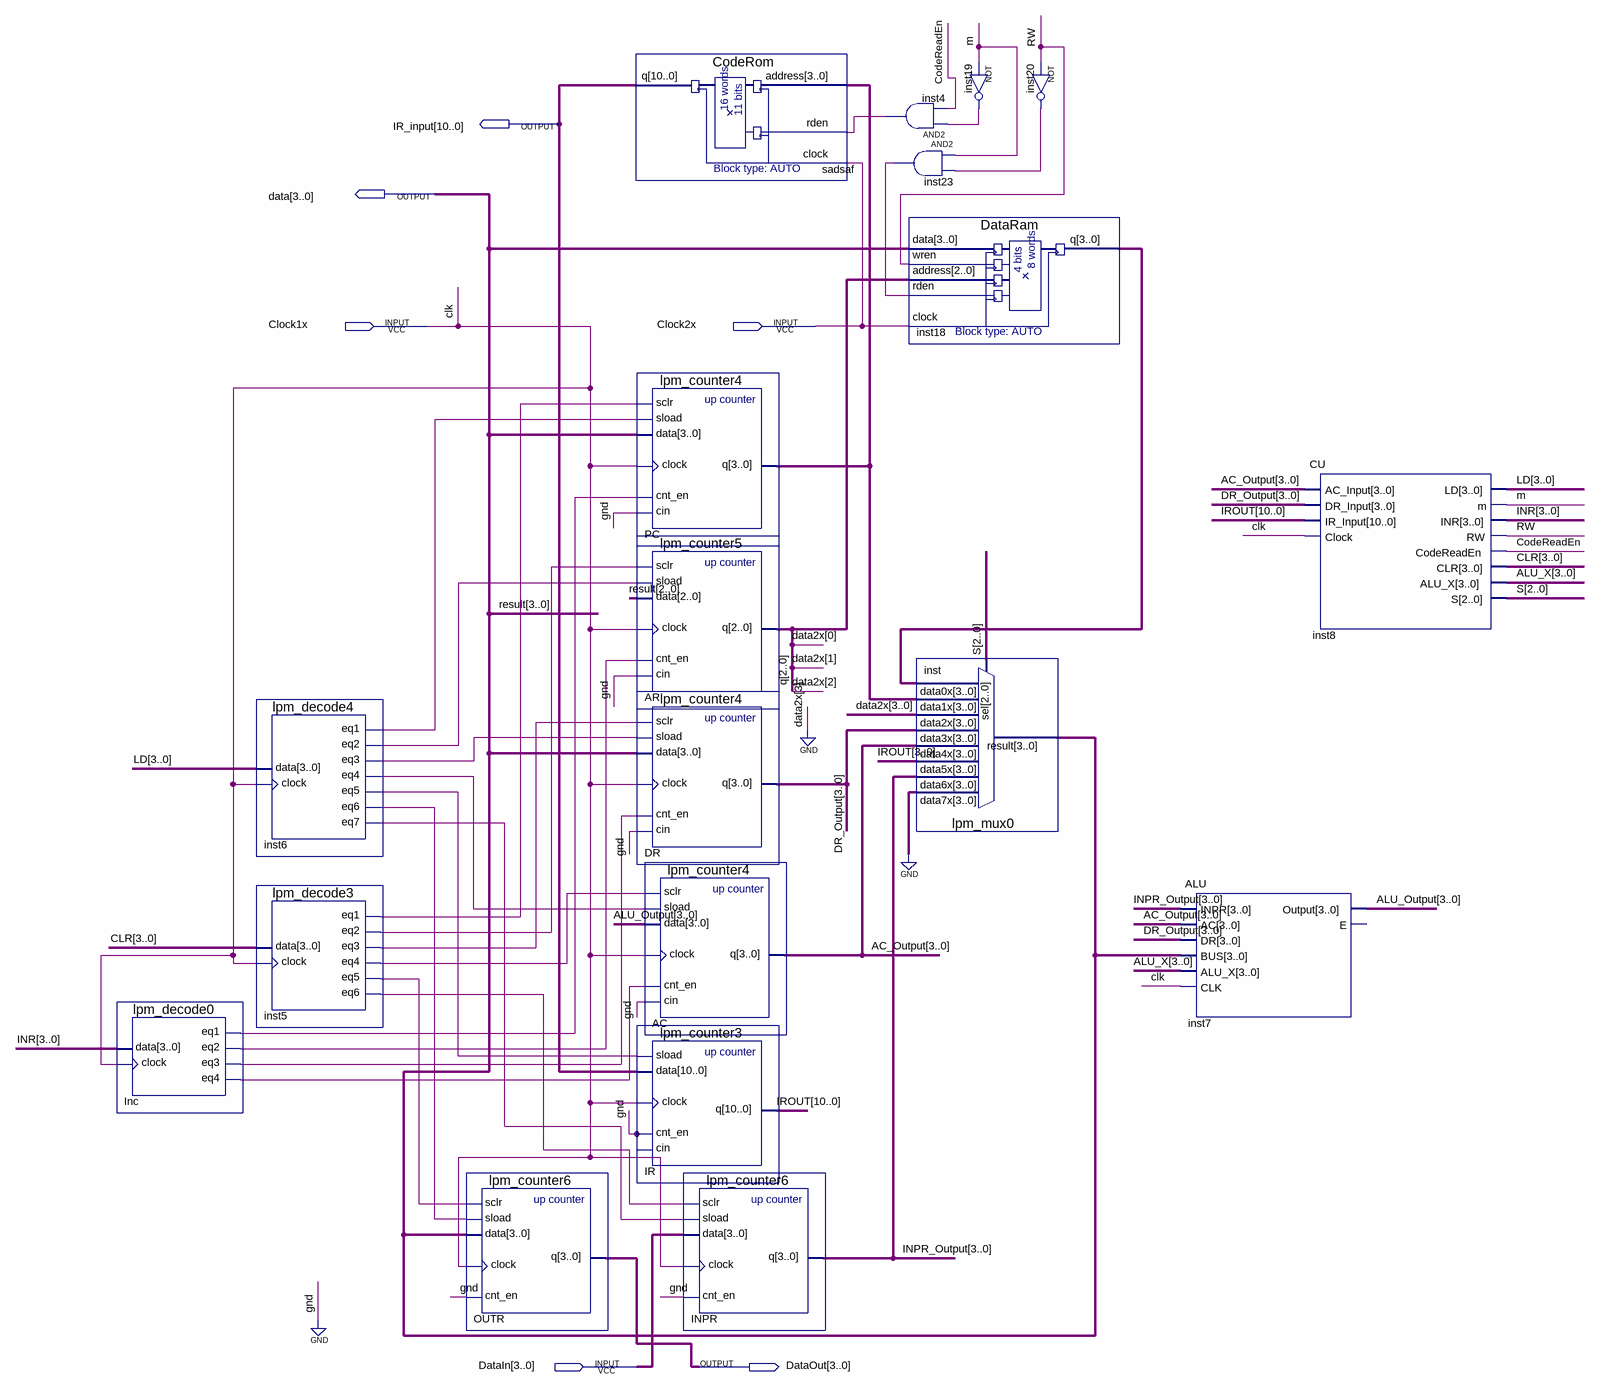
[diagram p0: schematic sheet]
// Quartus schematic Common_Bus_System.bdf as structural Verilog: 19 symbols, 6 pins
module Common_Bus_System (
  input  Clock1x,
  input  Clock2x,
  input  [3:0] DataIn,
  output [10:0] IR_input,
  output [3:0] data,
  output [3:0] DataOut
);

  wire CodeReadEn, Inc_eq1, Inc_eq2, Inc_eq3, Inc_eq4, inst4_out, inst5_eq1, inst5_eq2, inst5_eq3, inst5_eq4,
       inst5_eq5, inst5_eq6, inst6_eq1, inst6_eq2, inst6_eq3, inst6_eq4, inst6_eq5, inst6_eq6, inst6_eq7,
       inst19_out, inst20_out, inst23_out, m, RW;
  wire [2:0] data2x, q, S;
  wire [3:0] AC_Output, ALU_Output, ALU_X, CLR, DR_Output, INPR_Output, INR, inst18_q, LD, PC_q;
  wire [10:0] IROUT;

  lpm_decode0 Inc (.data(INR), .clock(Clock1x), .eq1(Inc_eq1), .eq2(Inc_eq2), .eq3(Inc_eq3), .eq4(Inc_eq4));
  lpm_decode4 inst6 (
    .data(LD), .clock(Clock1x), .eq1(inst6_eq1), .eq2(inst6_eq2), .eq3(inst6_eq3), .eq4(inst6_eq4),
    .eq5(inst6_eq5), .eq6(inst6_eq6), .eq7(inst6_eq7));
  lpm_decode3 inst5 (
    .data(CLR), .clock(Clock1x), .eq1(inst5_eq1), .eq2(inst5_eq2), .eq3(inst5_eq3), .eq4(inst5_eq4),
    .eq5(inst5_eq5), .eq6(inst5_eq6));
  lpm_counter6 OUTR (.sclr(inst5_eq5), .sload(inst6_eq6), .data(data), .clock(Clock1x), .cnt_en(1'b0), .q(DataOut));
  CodeRom sadsaf (.address(PC_q), .rden(inst4_out), .clock(Clock2x), .q(IR_input));
  lpm_counter4 PC (
    .sclr(inst5_eq1), .sload(inst6_eq1), .data(data), .clock(Clock1x), .cnt_en(Inc_eq1), .cin(1'b0), .q(PC_q));
  lpm_counter5 AR (
    .sclr(inst5_eq2), .sload(inst6_eq2), .data(data[2:0]), .clock(Clock1x), .cnt_en(Inc_eq2), .cin(1'b0),
    .q(q));
  lpm_counter4 DR (
    .sclr(inst5_eq3), .sload(inst6_eq3), .data(data), .clock(Clock1x), .cnt_en(Inc_eq3), .cin(1'b0),
    .q(DR_Output));
  lpm_counter4 AC (
    .sclr(inst5_eq4), .sload(inst6_eq4), .data(ALU_Output), .clock(Clock1x), .cnt_en(Inc_eq4), .cin(1'b0),
    .q(AC_Output));
  lpm_counter3 IR (.sload(inst6_eq5), .data(IR_input), .clock(Clock1x), .cnt_en(1'b0), .cin(1'b0), .q(IROUT));
  lpm_counter6 INPR (
    .sclr(inst5_eq6), .sload(inst6_eq7), .data(DataIn), .clock(Clock1x), .cnt_en(1'b0), .q(INPR_Output));
  and inst4 (inst4_out, inst19_out, CodeReadEn);
  and inst23 (inst23_out, m, inst20_out);
  DataRam inst18 (.data(data), .wren(RW), .address(q), .rden(inst23_out), .clock(Clock2x), .q(inst18_q));
  lpm_mux0 inst (
    .data7x(4'b0000), .data6x(INPR_Output), .data5x(IROUT[3:0]), .data4x(AC_Output), .data3x(DR_Output),
    .data2x({1'b0, data2x}), .data1x(PC_q), .data0x(inst18_q), .sel(S), .result(data));
  not inst19 (inst19_out, m);
  not inst20 (inst20_out, RW);
  ALU inst7 (
    .INPR(INPR_Output), .AC(AC_Output), .DR(DR_Output), .BUS(data), .ALU_X(ALU_X), .CLK(Clock1x),
    .Output(ALU_Output));  // open: E
  CU inst8 (
    .AC_Input(AC_Output), .DR_Input(DR_Output), .IR_Input(IROUT), .Clock(Clock1x), .LD(LD), .m(m), .INR(INR),
    .RW(RW), .CodeReadEn(CodeReadEn), .CLR(CLR), .ALU_X(ALU_X), .S(S));

  // Other names for the same wires on the sheet: clk = Clock1x; result[3:0] = data
endmodule
